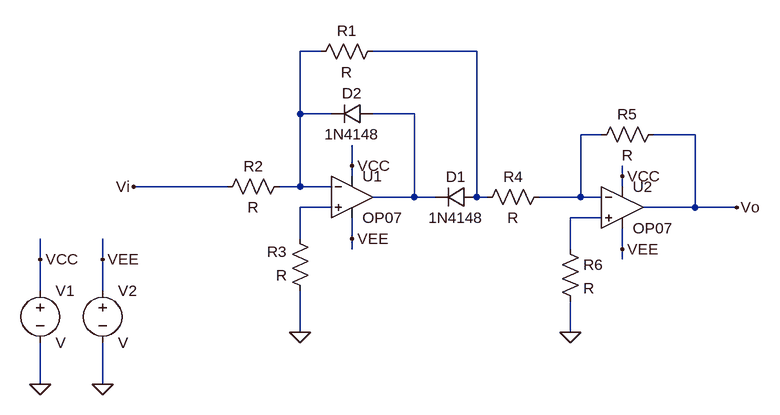
[diagram p0: schematic 1_7.asc]
1_7.asc, the LTspice schematic file:
Version 4
SHEET 1 880 680
WIRE 32 -64 0 -64
WIRE 272 -64 112 -64
WIRE 0 32 0 -64
WIRE 48 32 0 32
WIRE 176 32 112 32
WIRE 464 64 432 64
WIRE 608 64 544 64
WIRE 80 112 80 80
WIRE 80 128 80 112
WIRE 496 128 496 112
WIRE -112 144 -256 144
WIRE 0 144 0 32
WIRE 0 144 -32 144
WIRE 48 144 0 144
WIRE 496 144 496 128
WIRE 176 160 176 32
WIRE 176 160 112 160
WIRE 208 160 176 160
WIRE 272 160 272 -64
WIRE 288 160 272 160
WIRE 432 160 432 64
WIRE 432 160 368 160
WIRE 464 160 432 160
WIRE 48 176 0 176
WIRE 608 176 608 64
WIRE 608 176 528 176
WIRE 672 176 608 176
WIRE 464 192 416 192
WIRE 0 224 0 176
WIRE 80 224 80 192
WIRE 80 240 80 224
WIRE 416 240 416 192
WIRE 496 240 496 208
WIRE -400 256 -400 224
WIRE -304 256 -304 224
WIRE 496 256 496 240
WIRE -400 304 -400 256
WIRE -304 304 -304 256
WIRE 0 368 0 304
WIRE 416 368 416 320
WIRE -400 448 -400 384
WIRE -304 448 -304 384
FLAG 0 368 0
FLAG -256 144 Vi
FLAG 416 368 0
FLAG 672 176 Vo
FLAG -304 448 0
FLAG -400 448 0
FLAG -400 256 VCC
FLAG 80 112 VCC
FLAG 496 128 VCC
FLAG -304 256 VEE
FLAG 80 224 VEE
FLAG 496 240 VEE
SYMBOL OpAmps\\OP07 80 96 R0
SYMATTR InstName U1
SYMBOL OpAmps\\OP07 496 112 R0
SYMATTR InstName U2
SYMBOL diode 272 144 R90
WINDOW 0 0 32 VBottom 2
WINDOW 3 32 32 VTop 2
SYMATTR InstName D1
SYMATTR Value 1N4148
SYMBOL diode 112 16 R90
WINDOW 0 0 32 VBottom 2
WINDOW 3 32 32 VTop 2
SYMATTR InstName D2
SYMATTR Value 1N4148
SYMBOL res 128 -80 R90
WINDOW 0 0 56 VBottom 2
WINDOW 3 32 56 VTop 2
SYMATTR InstName R1
SYMBOL res -16 128 R90
WINDOW 0 0 56 VBottom 2
WINDOW 3 32 56 VTop 2
SYMATTR InstName R2
SYMBOL res 16 320 R180
WINDOW 0 36 76 Left 2
WINDOW 3 36 40 Left 2
SYMATTR InstName R3
SYMBOL res 272 176 R270
WINDOW 0 32 56 VTop 2
WINDOW 3 0 56 VBottom 2
SYMATTR InstName R4
SYMBOL res 448 80 R270
WINDOW 0 32 56 VTop 2
WINDOW 3 0 56 VBottom 2
SYMATTR InstName R5
SYMBOL res 400 224 R0
SYMATTR InstName R6
SYMBOL voltage -400 288 R0
SYMATTR InstName V1
SYMBOL voltage -304 288 R0
SYMATTR InstName V2

The netlist it stands for:
* 1_7.asc
XU1 N005 N001 VCC VEE N003 LT1001  ; OP07, pins In+ In- V+ V- OUT
XU2 N006 N004 VCC VEE Vo LT1001  ; OP07, pins In+ In- V+ V- OUT
D1 N002 N003 1N4148
D2 N003 N001 1N4148
R1 N002 N001 R
R2 N001 Vi R
R3 0 N005 R
R4 N002 N004 R
R5 N004 Vo R
R6 N006 0 R
V1 VCC 0 V
V2 VEE 0 V
.model D D
.lib standard.dio
.lib LTC.lib
.backanno
.end